# EAGLE design Interposer (EAGLE 9.6.1)
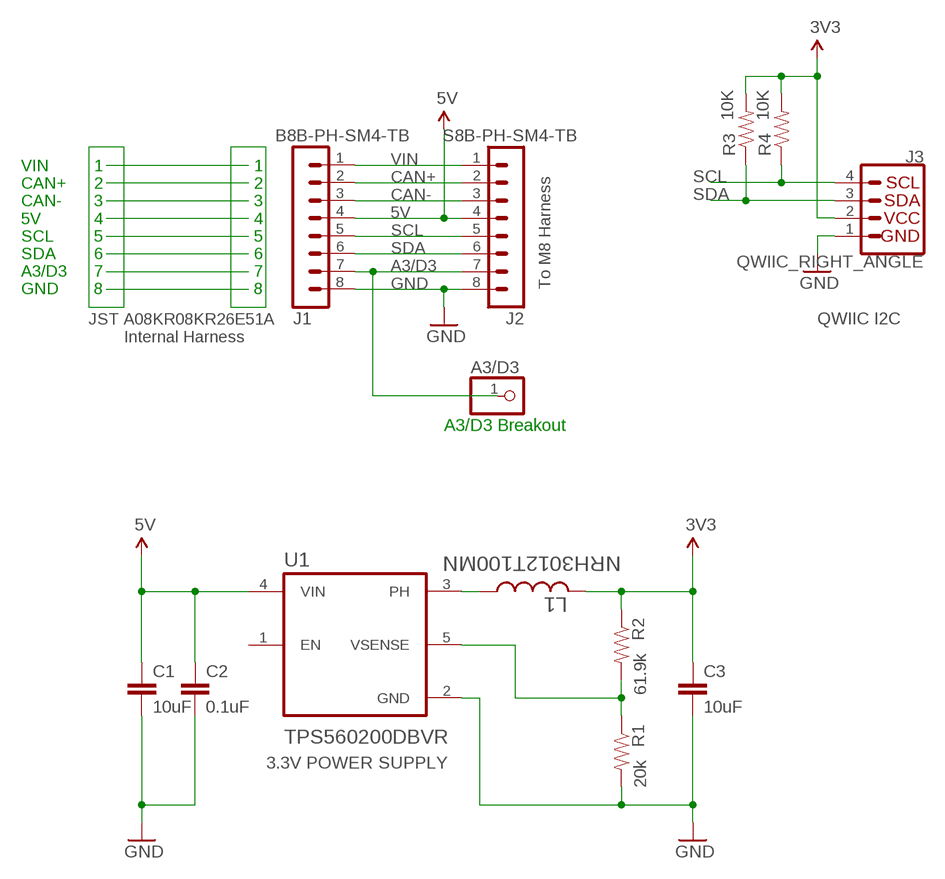
[diagram p0: schematic, sheet 1]

## Parts
A3/D3  PINHD-1X1  [1X01]
C1  10uF  CAP-10UF-0603  [0603-CAP]
C2  0.1uF  CAP-10UF-0603  [0603-CAP]
C3  10uF  CAP-10UF-0603  [0603-CAP]
J1  B8B-PH-SM4-TB  [B8B-PH-SM4-TB]
J2  S8B-PH-SM4-TB  [S8B-PH-SM4-TB]
J3  QWIIC_RIGHT_ANGLE  QWIIC_CONNECTORJS-1MM  [JST04_1MM_RA]
L1  NRH3012T100MN  [IND_TAIYO_NRH3012_TAY]
R1  20k  RES-10K-06030603  [0603-RES]
R2  61.9k  RES-10K-06030603  [0603-RES]
R3  10K  RES-10K-06030603  [0603-RES]
R4  10K  RES-10K-06030603  [0603-RES]
U1  TPS560200DBVR  [SOT95P280X145-5N]

## Nets
3V3: C3.1 J3.2 L1.2 R2.1 R3.2 R4.2
3V3_SENSE: R1.1 R2.2 U1.5(VSENSE)
3V3_SW: L1.1 U1.3(PH)
5V: C1.1 C2.1 J1.4 J2.4 U1.4(VIN)
A3/D3: A3/D3.1 J1.7 J2.7
CAN+: J1.2 J2.2
CAN-: J1.3 J2.3
GND: C1.2 C2.2 C3.2 J1.8 J2.8 J3.1 R1.2 U1.2(GND)
SCL: J1.5 J2.5 J3.4 R4.1
SDA: J1.6 J2.6 J3.3 R3.1
VIN: J1.1 J2.1
Unconnected: U1.1(EN)

## Notes on the sheet
- To M8 Harness
- VIN
  CAN+
  CAN-
  5V
  SCL
  SDA
  A3/D3
  GND
- 1
  2
  3
  4
  5
  6
  7
  8
- 1
  2
  3
  4
  5
  6
  7
  8
- JST A08KR08KR26E51A | QWIIC I2C
- Internal Harness
- A3/D3 Breakout
- 3.3V POWER SUPPLY

## Library data of the parts
A3/D3 = pinhead:PINHD-1X1: PIN HEADER
C1 C3 = rickk2:CAP-10UF-0603: CAP CER 10UF 16V X5R 0805 $ 0.21 https://www.digikey.com/product-detail/en/murata-electronics-north-america/GRM21BR61C106KE15L/490-3886-1-ND/965928
C2 = rickk2:CAP-10UF-0603: CAP CER 10UF 16V X5R 0805 $ 0.21 https://www.digikey.com/product-detail/en/murata-electronics-north-america/GRM21BR61C106KE15L/490-3886-1-ND/965928; VALUE: 10uF
J1 = con-JST PH:B8B-PH: JST PH series header 2.00mm pitch disconnectable crimp style connectors, vertical (side entry type), 8 pins
J2 = con-JST PH:S8B-PH: JST PH series header 2.00mm pitch disconnectable crimp style connectors, horizontal (side entry type), 8 pins
J3 = rickk2:QWIIC_CONNECTOR: SparkFun I2C Standard Qwiic Connector An SMD 1mm pitch JST connector makes it easy and quick (get it? Qwiic?) to connect I2C devices to each other. The Qwiic system <http://www.sparkfun.com/qwiic> enables fast and solderless connection between popular platforms and various sensors and actuators. We carry 200mm <https://www.sparkfun.com/products/14204>, 100mm <https://www.sparkfun.com/products/14205>, 50mm <https://www.sparkfun.com/products/14206>, and breadboard friendly <https://www.sparkfun.com/products/14207> Qwiic cables. We also offer 10 pcs strips <https://www.sparkfun.com/products/14323> the SMD connectors.; PROD_ID: CONN-13694
L1 = NRH3012T100MN:NRH3012T100MN; BUILT_BY: EMA_UL_Team; MANUFACTURER_PART_NUMBER: NRH3012T100MN; SOURCELIBRARY: TaiyoYuden_2011-01-01_IND_NRx; VENDOR: TAIYO YUDEN
R1 R2 = rickk2:RES-10K-0603: RES SMD 10K OHM 5% 1/4W 0603 $ 0.10 https://www.digikey.com/product-detail/en/panasonic-electronic-components/ERJ-PA3J103V/P10KBZCT-ND/5036237; VALUE: 10K
R3 R4 = rickk2:RES-10K-0603: RES SMD 10K OHM 5% 1/4W 0603 $ 0.10 https://www.digikey.com/product-detail/en/panasonic-electronic-components/ERJ-PA3J103V/P10KBZCT-ND/5036237
U1 = TPS560200DBVR:TPS560200DBVR; DESCRIPTION: 17V Input, 500mA Synchronous Step-Down Regulator in SOT-23 with Advanced Eco-Mode&trade; 5-SOT-23 -40 to 125; DIGI-KEY_PART_NUMBER: 296-38559-1-ND; DIGIKEY-PURCHASE-URL: https://snapeda.com/shop?store=DigiKey&id=549200; MF: Texas Instruments; MOUSER-PURCHASE-URL: https://snapeda.com/shop?store=Mouser&id=549200; MP: TPS560200DBVR; PACKAGE: SOT-23-5 Texas Instruments; TEXAS_INSTRUMENTS-PURCHASE-URL: https://snapeda.com/shop?store=Texas+Instruments&id=549200

## Board
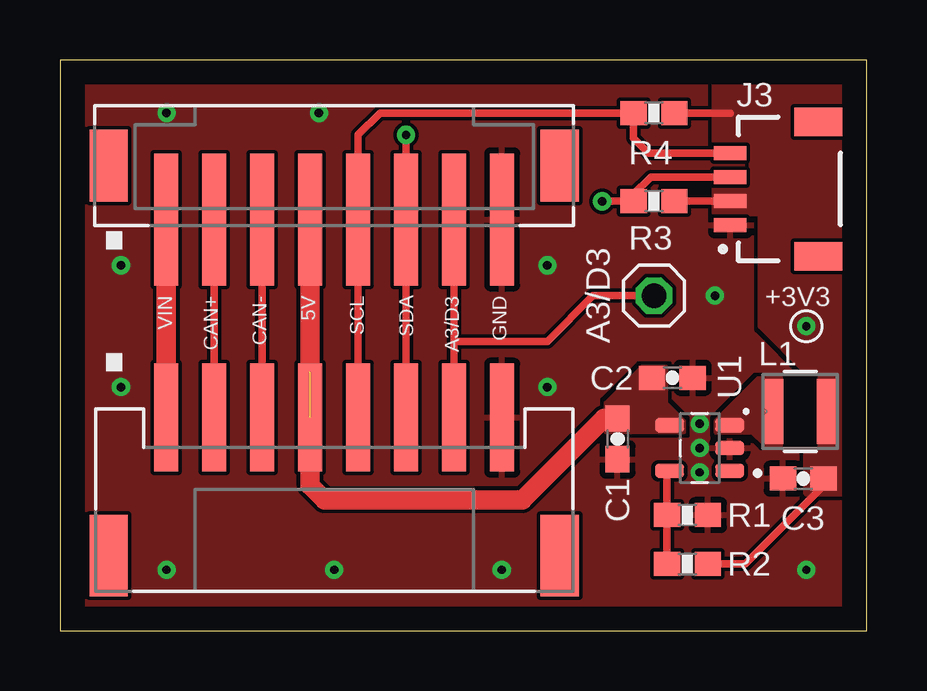
[diagram p1: board, top side]
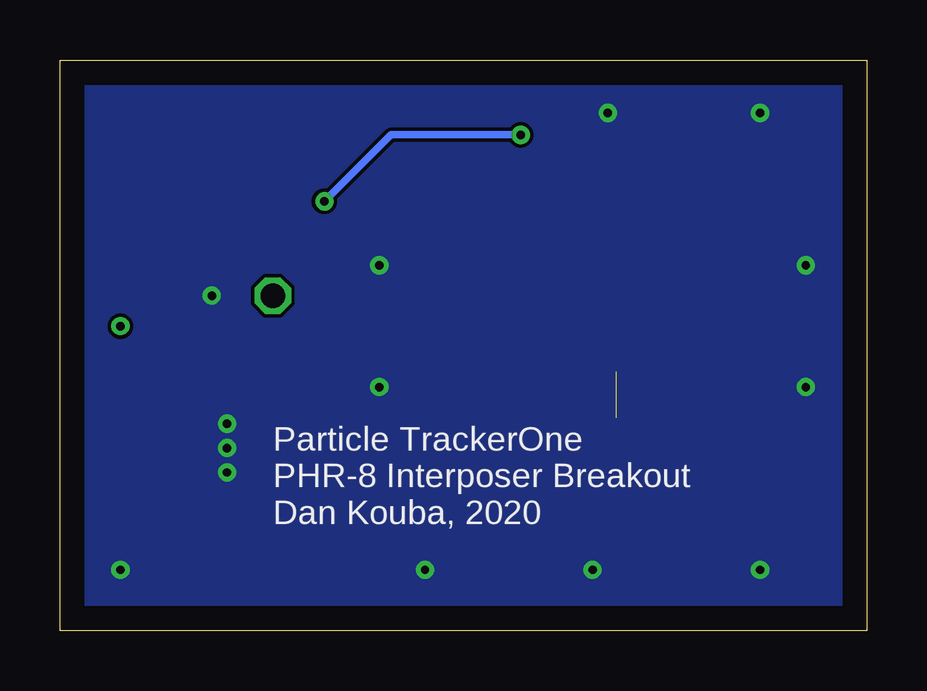
[diagram p2: board, bottom side, seen from below]

Size 33.63 x 23.8 mm. Coordinates in mm from the lower left corner, seen from the top.
Outline: 0,0 33.63,0 33.63,23.8 0,23.8 0,0
Copper layers (1*16): Top 0.035mm / dielectric 1.5mm / Bottom 0.035mm
Design rules "default": minimum track width 6mil, minimum drill 0.35mm, track to track 6mil, track to pad 6mil, pad to pad 6mil, via to via 6mil, smd to smd 6mil, copper to edge 40mil, drill to drill 6mil, minimum pad ring 10mil, minimum via ring 8mil, stop-mask expansion 4mil, vias tented up to drill 0mil, thermal gap 10mil

### Footprints (pad centres in the part's own frame; a part is rotated, then mirrored left to right if it is on the bottom)
1X01 = drill 1.016 octagon: 1 0,0
0603-CAP = smd 1.1 x 1: 1 -0.85,0; 2 0.85,0
B8B-PH-SM4-TB = smd 1 x 5.5: 1 7,0; 2 5,0; 3 3,0; 4 1,0; 5 -1,0; 6 -3,0; 7 -5,0; 8 -7,0 | smd 1.6 x 3: M1 9.4,-2.25; M2 -9.4,-2.25
S8B-PH-SM4-TB = smd 1 x 4.5: 1 7,0; 2 5,0; 3 3,0; 4 1,0; 5 -1,0; 6 -3,0; 7 -5,0; 8 -7,0 | smd 1.6 x 3.4: M1 9.4,5.75; M2 -9.4,5.75
JST04_1MM_RA = smd 0.6 x 1.35: 1 -1.5,0; 2 -0.5,0; 3 0.5,0; 4 1.5,0 | smd 1.2 x 2: NC1 2.8,-3.675; NC2 -2.8,-3.675
IND_TAIYO_NRH3012_TAY = smd 0.8 x 2.692: 1 -1.099,0; 2 1.099,0
0603-RES = smd 1.1 x 1: 1 -0.85,0; 2 0.85,0
SOT95P280X145-5N = smd 1.21 x 0.59: 1 -1.255,0.95; 2 -1.255,0; 3 -1.255,-0.95; 4 1.255,-0.95; 5 1.255,0.95

### Placement (x,y rotation side)
A3/D3  24.77,13.97 0 top
C1  23.24,8 270 top
C2  25.53,10.54 0 top
C3  30.99,6.35 180 top
J1  11.43,17.14 180 top
J2  11.43,8.89 180 top
J3  27.94,18.41 90 top
L1  30.86,9.14 0 top
R1  26.16,4.83 0 top
R2  26.16,2.79 180 top
R3  24.77,17.91 0 top
R4  24.77,21.59 0 top
U1  26.67,7.62 180 top

### Tracks (layer width: path | path; a pad name or v marks a point on that pad's centre or on a via)
3V3  (via drill 0.35)
  Top 0.305: R2.1 28.57,2.79 31.84,6.06 C3.1 | J3.2 R3.2 | R4.2 27.94,21.59
  other vias: 31.11,12.7
  pour Top (no thermals): 31.11,5.71 31.11,10.79 29.21,12.7 29.21,17.4 27.3,17.4 27.3,24.51 34.42,24.51 34.42,5.71
3V3_SENSE
  Top 0.305: R2.2 R1.1 25.31,6.57
  Top 0.508: R2.2 25.41,2.9 | 25.31,6.57 U1.5
3V3_SW
  pour Top (no thermals): 27.3,8.26 28.83,8.26 29.34,7.75 30.1,7.75 30.1,10.54 29.08,10.54 27.3,8.76
5V  (1 unrouted)
  Top 0.813: 10.43,10.79 J1.4 | J2.4 10.43,6.05 11.02,5.46 19.28,5.46 22.67,8.85 C1.1
  pour Top (no thermals): 26.04,8.26 22.73,8.26 22.73,9.53 24.26,11.05 25.27,11.05 25.27,9.53 26.04,8.76
A3/D3
  Top 0.305: 16.43,12.06 20.32,12.06 22.23,13.97 A3/D3.1 | J1.7 16.43,12.06 | J2.7 16.43,12.06
CAN+
  Top 0.305: J2.2 J1.2
CAN-
  Top 0.305: J2.3 J1.3
GND  (via drill 0.35)
  other vias: 18.41,2.54 2.54,10.16 4.45,2.54 20.32,10.16 31.11,2.54 4.45,21.59 10.79,21.59 27.3,13.97 26.67,7.62 26.67,8.64 26.67,6.6 20.32,15.24 2.54,15.24 11.43,2.54
  pour Top (rank 6): 0,0 0,25.4 39.37,25.4 39.37,0
  pour Bottom (rank 6): 0,0 0,26.67 40.64,26.67 40.64,0
SCL
  Top 0.305: J2.5 J1.5 | 12.45,17.16 J1.5 | J3.4 24.54,19.91 23.91,20.54 R4.1 13.34,21.59 12.43,20.68 J1.5
SDA  (via drill 0.35)
  Top 0.305: J3.3 24.63,18.91 23.91,18.2 R3.1 v22.61,17.91 | J2.6 J1.6 v14.43,20.67 v14.43,20.68
  Bottom 0.305: v14.43,20.68 19.84,20.68 v22.61,17.91
VIN
  Top 0.813: J1.1 J2.1

### Text on the board
tNames: . | VIN | CAN+ | CAN- | 5V | SCL | SDA | A3/D3 | GND | +3V3 | .
bNames: Particle TrackerOne / PHR-8 Interposer Breakout / Dan Kouba, 2020